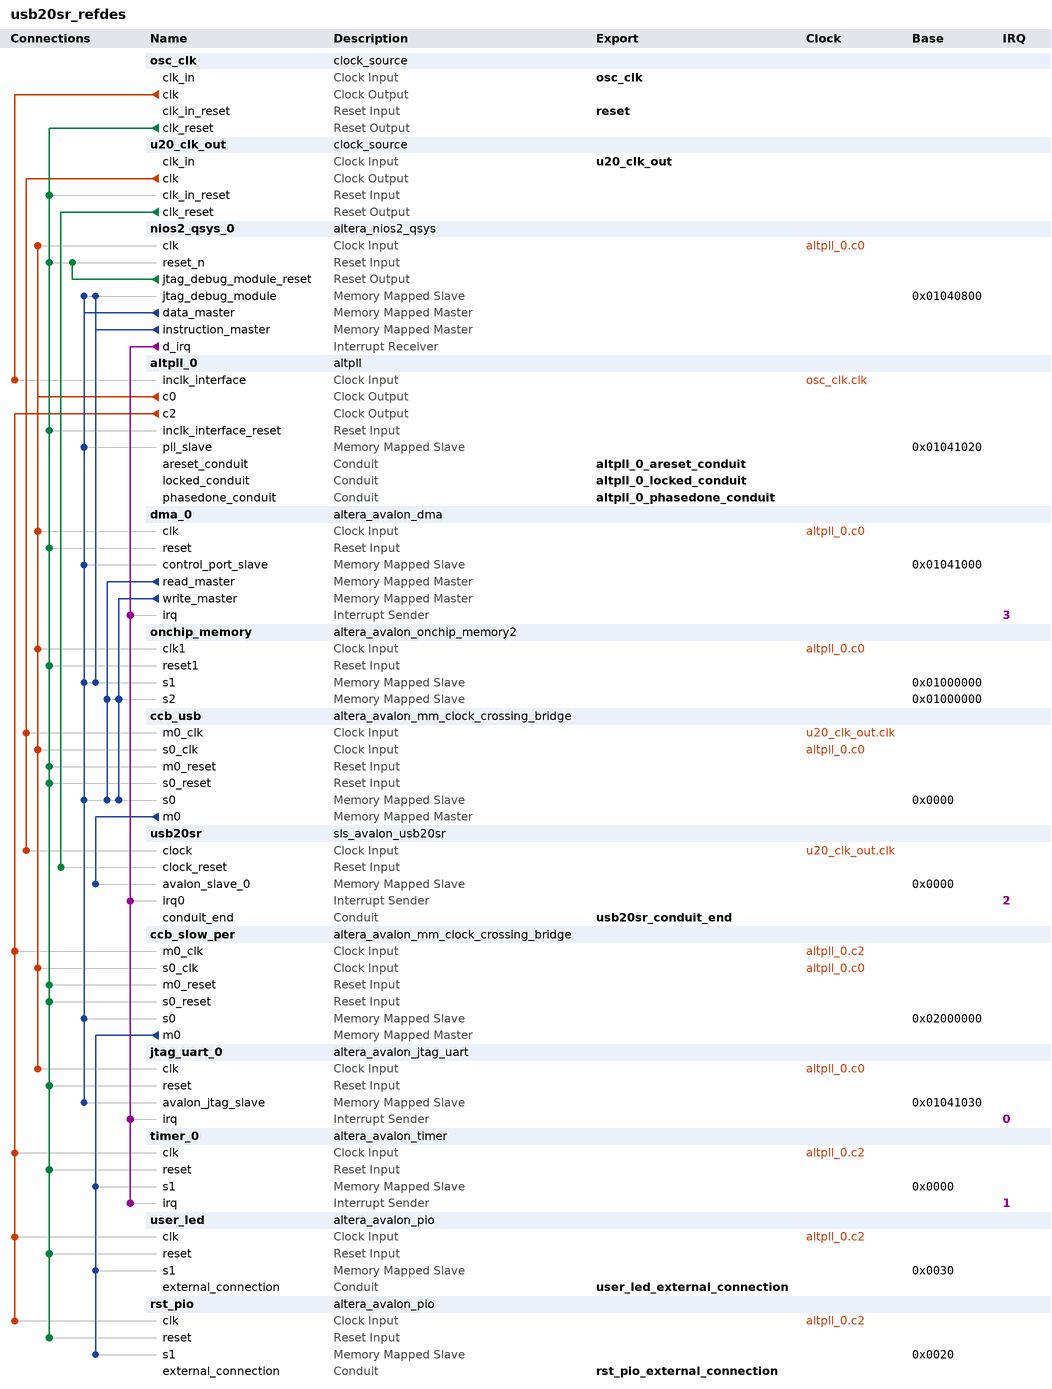
[diagram p0: system contents]
# Platform Designer (Qsys) system usb20sr_refdes, MAX 10 10M50DAF484C6GES
# Parameters at their usual value, and those the tool derives, are not listed.
package require -exact qsys 14.1
create_system usb20sr_refdes
set_project_property DEVICE_FAMILY {MAX 10}
set_project_property DEVICE 10M50DAF484C6GES

add_instance osc_clk clock_source 14.1
set_instance_parameter_value osc_clk clockFrequency 50000000

add_instance u20_clk_out clock_source 14.1
set_instance_parameter_value u20_clk_out clockFrequency 60000000

add_instance nios2_qsys_0 altera_nios2_qsys 14.1
set_instance_parameter_value nios2_qsys_0 breakSlave nios2_qsys_0.jtag_debug_module
set_instance_parameter_value nios2_qsys_0 exceptionSlave onchip_memory.s1
set_instance_parameter_value nios2_qsys_0 icache_size 4096
set_instance_parameter_value nios2_qsys_0 impl Fast
set_instance_parameter_value nios2_qsys_0 mmu_TLBMissExcSlave None
set_instance_parameter_value nios2_qsys_0 muldiv_multiplierType DSPBlock
set_instance_parameter_value nios2_qsys_0 resetSlave onchip_memory.s1
set_instance_parameter_value nios2_qsys_0 resetrequest_enabled true

add_instance altpll_0 altpll 14.1
set_instance_parameter_value altpll_0 CLK0_DIVIDE_BY 1
set_instance_parameter_value altpll_0 CLK0_MULTIPLY_BY 2
set_instance_parameter_value altpll_0 CLK1_DIVIDE_BY 1
set_instance_parameter_value altpll_0 CLK1_DUTY_CYCLE 50
set_instance_parameter_value altpll_0 CLK1_MULTIPLY_BY 2
set_instance_parameter_value altpll_0 CLK1_PHASE_SHIFT 0
set_instance_parameter_value altpll_0 CLK2_DIVIDE_BY 25
set_instance_parameter_value altpll_0 CLK2_DUTY_CYCLE 50
set_instance_parameter_value altpll_0 CLK2_MULTIPLY_BY 24
set_instance_parameter_value altpll_0 CLK2_PHASE_SHIFT 0
set_instance_parameter_value altpll_0 INCLK0_INPUT_FREQUENCY 20000
set_instance_parameter_value altpll_0 PORT_ARESET PORT_USED
set_instance_parameter_value altpll_0 PORT_LOCKED PORT_USED
set_instance_parameter_value altpll_0 PORT_clk1 PORT_USED
set_instance_parameter_value altpll_0 PORT_clk2 PORT_USED
set_instance_parameter_value altpll_0 PORT_clk3 PORT_UNUSED

add_instance dma_0 altera_avalon_dma 14.1
set_instance_parameter_value dma_0 allowByteTransactions true
set_instance_parameter_value dma_0 allowDoubleWordTransactions true
set_instance_parameter_value dma_0 allowHalfWordTransactions true
set_instance_parameter_value dma_0 allowQuadWordTransactions true
set_instance_parameter_value dma_0 burstEnable false
set_instance_parameter_value dma_0 fifoDepth 32
set_instance_parameter_value dma_0 maxBurstSize 128
set_instance_parameter_value dma_0 minimumDmaTransactionRegisterWidth 13

add_instance onchip_memory altera_avalon_onchip_memory2 14.1
set_instance_parameter_value onchip_memory dataWidth 32
set_instance_parameter_value onchip_memory dualPort true
set_instance_parameter_value onchip_memory initMemContent false
set_instance_parameter_value onchip_memory initializationFileName "D:\\SVN\\max10\\test\\peli\\deca_usb_ulpi\\Enum_ram.hex"
set_instance_parameter_value onchip_memory memorySize 135000
set_instance_parameter_value onchip_memory singleClockOperation true

add_instance ccb_usb altera_avalon_mm_clock_crossing_bridge 14.1
set_instance_parameter_value ccb_usb ADDRESS_WIDTH 21
set_instance_parameter_value ccb_usb COMMAND_FIFO_DEPTH 8
set_instance_parameter_value ccb_usb DATA_WIDTH 32
set_instance_parameter_value ccb_usb MASTER_SYNC_DEPTH 3
set_instance_parameter_value ccb_usb MAX_BURST_SIZE 1
set_instance_parameter_value ccb_usb RESPONSE_FIFO_DEPTH 16
set_instance_parameter_value ccb_usb SLAVE_SYNC_DEPTH 3
set_instance_parameter_value ccb_usb USE_AUTO_ADDRESS_WIDTH 0

add_instance usb20sr sls_avalon_usb20sr 1.3
set_instance_parameter_value usb20sr Enum_data_file Enum_ram.hex
set_instance_parameter_value usb20sr IN_DEPTH 512
set_instance_parameter_value usb20sr Interface_sel 0
set_instance_parameter_value usb20sr OUT_DEPTH 512
set_instance_parameter_value usb20sr Simulation 1

add_instance ccb_slow_per altera_avalon_mm_clock_crossing_bridge 14.1
set_instance_parameter_value ccb_slow_per ADDRESS_WIDTH 7
set_instance_parameter_value ccb_slow_per COMMAND_FIFO_DEPTH 8
set_instance_parameter_value ccb_slow_per DATA_WIDTH 32
set_instance_parameter_value ccb_slow_per MASTER_SYNC_DEPTH 3
set_instance_parameter_value ccb_slow_per MAX_BURST_SIZE 1
set_instance_parameter_value ccb_slow_per RESPONSE_FIFO_DEPTH 32
set_instance_parameter_value ccb_slow_per SLAVE_SYNC_DEPTH 3
set_instance_parameter_value ccb_slow_per USE_AUTO_ADDRESS_WIDTH 0

add_instance jtag_uart_0 altera_avalon_jtag_uart 14.1
set_instance_parameter_value jtag_uart_0 simInteractiveOptions INTERACTIVE_ASCII_OUTPUT

add_instance timer_0 altera_avalon_timer 14.1
set_instance_parameter_value timer_0 period 1
set_instance_parameter_value timer_0 periodUnits MSEC

add_instance user_led altera_avalon_pio 14.1
set_instance_parameter_value user_led direction Output
set_instance_parameter_value user_led width 8

add_instance rst_pio altera_avalon_pio 14.1
set_instance_parameter_value rst_pio direction Output
set_instance_parameter_value rst_pio resetValue 1
set_instance_parameter_value rst_pio width 1

# connections
add_connection altpll_0.c0 ccb_slow_per.s0_clk clock
add_connection altpll_0.c0 ccb_usb.s0_clk clock
add_connection altpll_0.c0 dma_0.clk clock
add_connection altpll_0.c0 jtag_uart_0.clk clock
add_connection altpll_0.c0 nios2_qsys_0.clk clock
add_connection altpll_0.c0 onchip_memory.clk1 clock
add_connection altpll_0.c2 ccb_slow_per.m0_clk clock
add_connection altpll_0.c2 rst_pio.clk clock
add_connection altpll_0.c2 timer_0.clk clock
add_connection altpll_0.c2 user_led.clk clock
add_connection osc_clk.clk altpll_0.inclk_interface clock
add_connection u20_clk_out.clk ccb_usb.m0_clk clock
add_connection u20_clk_out.clk usb20sr.clock clock
add_connection nios2_qsys_0.jtag_debug_module_reset nios2_qsys_0.reset_n reset
add_connection osc_clk.clk_reset altpll_0.inclk_interface_reset reset
add_connection osc_clk.clk_reset ccb_slow_per.m0_reset reset
add_connection osc_clk.clk_reset ccb_slow_per.s0_reset reset
add_connection osc_clk.clk_reset ccb_usb.m0_reset reset
add_connection osc_clk.clk_reset ccb_usb.s0_reset reset
add_connection osc_clk.clk_reset dma_0.reset reset
add_connection osc_clk.clk_reset jtag_uart_0.reset reset
add_connection osc_clk.clk_reset nios2_qsys_0.reset_n reset
add_connection osc_clk.clk_reset onchip_memory.reset1 reset
add_connection osc_clk.clk_reset rst_pio.reset reset
add_connection osc_clk.clk_reset timer_0.reset reset
add_connection osc_clk.clk_reset u20_clk_out.clk_in_reset reset
add_connection osc_clk.clk_reset user_led.reset reset
add_connection u20_clk_out.clk_reset usb20sr.clock_reset reset
add_connection ccb_slow_per.m0 rst_pio.s1 avalon
set_connection_parameter_value ccb_slow_per.m0/rst_pio.s1 baseAddress 0x0020
add_connection ccb_slow_per.m0 timer_0.s1 avalon
set_connection_parameter_value ccb_slow_per.m0/timer_0.s1 baseAddress 0x0000
add_connection ccb_slow_per.m0 user_led.s1 avalon
set_connection_parameter_value ccb_slow_per.m0/user_led.s1 baseAddress 0x0030
add_connection ccb_usb.m0 usb20sr.avalon_slave_0 avalon
set_connection_parameter_value ccb_usb.m0/usb20sr.avalon_slave_0 baseAddress 0x0000
add_connection dma_0.read_master ccb_usb.s0 avalon
set_connection_parameter_value dma_0.read_master/ccb_usb.s0 baseAddress 0x0000
add_connection dma_0.read_master onchip_memory.s2 avalon
set_connection_parameter_value dma_0.read_master/onchip_memory.s2 baseAddress 0x01000000
add_connection dma_0.write_master ccb_usb.s0 avalon
set_connection_parameter_value dma_0.write_master/ccb_usb.s0 baseAddress 0x0000
add_connection dma_0.write_master onchip_memory.s2 avalon
set_connection_parameter_value dma_0.write_master/onchip_memory.s2 baseAddress 0x01000000
add_connection nios2_qsys_0.data_master altpll_0.pll_slave avalon
set_connection_parameter_value nios2_qsys_0.data_master/altpll_0.pll_slave baseAddress 0x01041020
add_connection nios2_qsys_0.data_master ccb_slow_per.s0 avalon
set_connection_parameter_value nios2_qsys_0.data_master/ccb_slow_per.s0 baseAddress 0x02000000
add_connection nios2_qsys_0.data_master ccb_usb.s0 avalon
set_connection_parameter_value nios2_qsys_0.data_master/ccb_usb.s0 baseAddress 0x0000
add_connection nios2_qsys_0.data_master dma_0.control_port_slave avalon
set_connection_parameter_value nios2_qsys_0.data_master/dma_0.control_port_slave baseAddress 0x01041000
add_connection nios2_qsys_0.data_master jtag_uart_0.avalon_jtag_slave avalon
set_connection_parameter_value nios2_qsys_0.data_master/jtag_uart_0.avalon_jtag_slave baseAddress 0x01041030
add_connection nios2_qsys_0.data_master nios2_qsys_0.jtag_debug_module avalon
set_connection_parameter_value nios2_qsys_0.data_master/nios2_qsys_0.jtag_debug_module baseAddress 0x01040800
add_connection nios2_qsys_0.data_master onchip_memory.s1 avalon
set_connection_parameter_value nios2_qsys_0.data_master/onchip_memory.s1 baseAddress 0x01000000
add_connection nios2_qsys_0.instruction_master nios2_qsys_0.jtag_debug_module avalon
set_connection_parameter_value nios2_qsys_0.instruction_master/nios2_qsys_0.jtag_debug_module baseAddress 0x01040800
add_connection nios2_qsys_0.instruction_master onchip_memory.s1 avalon
set_connection_parameter_value nios2_qsys_0.instruction_master/onchip_memory.s1 baseAddress 0x01000000
add_connection nios2_qsys_0.d_irq dma_0.irq interrupt
set_connection_parameter_value nios2_qsys_0.d_irq/dma_0.irq irqNumber 3
add_connection nios2_qsys_0.d_irq jtag_uart_0.irq interrupt
set_connection_parameter_value nios2_qsys_0.d_irq/jtag_uart_0.irq irqNumber 0
add_connection nios2_qsys_0.d_irq timer_0.irq interrupt
set_connection_parameter_value nios2_qsys_0.d_irq/timer_0.irq irqNumber 1
add_connection nios2_qsys_0.d_irq usb20sr.irq0 interrupt
set_connection_parameter_value nios2_qsys_0.d_irq/usb20sr.irq0 irqNumber 2

# exported interfaces
add_interface altpll_0_areset_conduit conduit end
set_interface_property altpll_0_areset_conduit EXPORT_OF altpll_0.areset_conduit
add_interface altpll_0_locked_conduit conduit end
set_interface_property altpll_0_locked_conduit EXPORT_OF altpll_0.locked_conduit
add_interface altpll_0_phasedone_conduit conduit end
set_interface_property altpll_0_phasedone_conduit EXPORT_OF altpll_0.phasedone_conduit
add_interface osc_clk clock sink
set_interface_property osc_clk EXPORT_OF osc_clk.clk_in
add_interface reset reset sink
set_interface_property reset EXPORT_OF osc_clk.clk_in_reset
add_interface rst_pio_external_connection conduit end
set_interface_property rst_pio_external_connection EXPORT_OF rst_pio.external_connection
add_interface u20_clk_out clock sink
set_interface_property u20_clk_out EXPORT_OF u20_clk_out.clk_in
add_interface usb20sr_conduit_end conduit end
set_interface_property usb20sr_conduit_end EXPORT_OF usb20sr.conduit_end
add_interface user_led_external_connection conduit end
set_interface_property user_led_external_connection EXPORT_OF user_led.external_connection

set_interconnect_requirement {$system} qsys_mm.clockCrossingAdapter HANDSHAKE
set_interconnect_requirement {$system} qsys_mm.maxAdditionalLatency 0

save_system usb20sr_refdes.qsys
